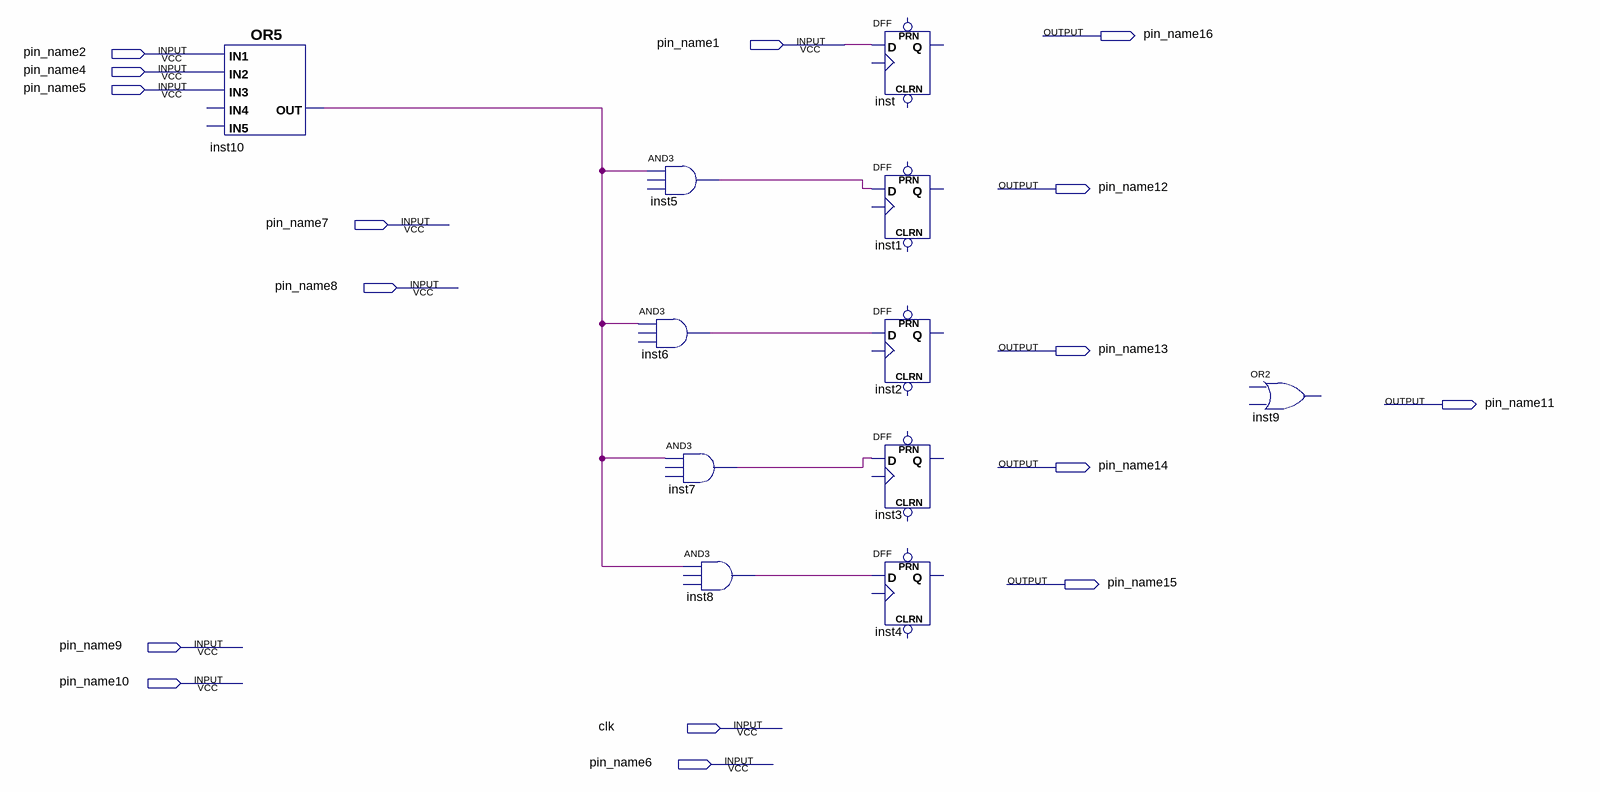
[diagram p0: schematic sheet]
// Quartus schematic controlpath.bdf as structural Verilog: 11 symbols, 16 pins
module controlpath (
  input  pin_name1,
  input  pin_name2,
  input  pin_name4,
  input  pin_name5,
  input  pin_name7,
  input  pin_name8,
  input  pin_name9,
  input  pin_name10,
  input  clk,
  input  pin_name6,
  output pin_name16,
  output pin_name12,
  output pin_name13,
  output pin_name11,
  output pin_name14,
  output pin_name15
);

  wire inst5_out, inst6_out, inst7_out, inst8_out, inst10_out;

  or inst10 (inst10_out, pin_name2, pin_name4, pin_name5);  // open: IN4, IN5
  buf inst5 (inst5_out, inst10_out);  // AND3 open: IN2, IN3
  buf inst6 (inst6_out, inst10_out);  // AND3 open: IN2, IN3
  buf inst7 (inst7_out, inst10_out);  // AND3 open: IN2, IN3
  buf inst8 (inst8_out, inst10_out);  // AND3 open: IN2, IN3
  DFF inst (.D(pin_name1));  // open: CLRN, CLK, PRN, Q
  DFF inst1 (.D(inst5_out));  // open: CLRN, CLK, PRN, Q
  DFF inst2 (.D(inst6_out));  // open: CLRN, CLK, PRN, Q
  DFF inst3 (.D(inst7_out));  // open: CLRN, CLK, PRN, Q
  DFF inst4 (.D(inst8_out));  // open: CLRN, CLK, PRN, Q
  // OR2 inst9 is placed but not wired
endmodule
